# EAGLE design edu_shield (EAGLE 9.0.1)
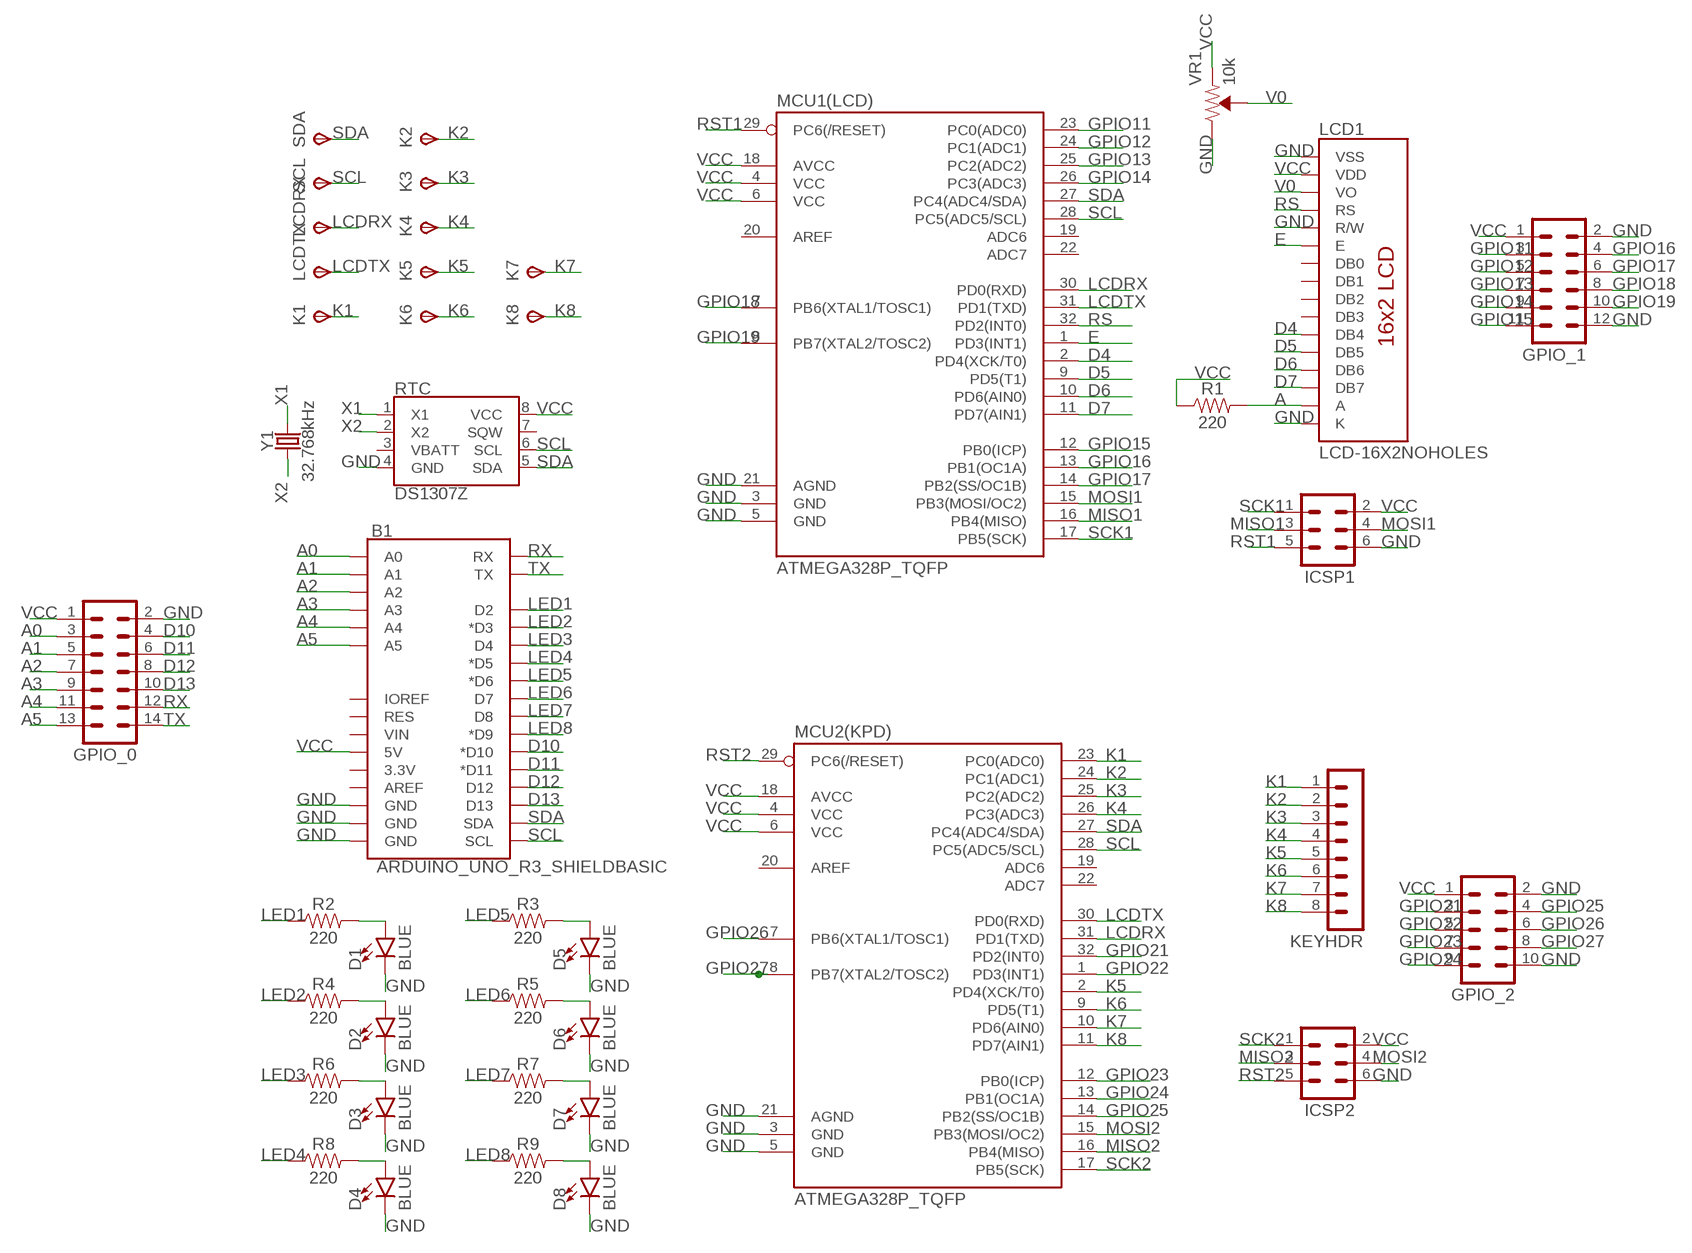
[diagram p0: schematic, sheet 1]

## Parts
B1  ARDUINO_UNO_R3_SHIELDBASIC  [UNO_R3_SHIELD]
D1  BLUE  LED-BLUE0603  [LED-0603]
D2  BLUE  LED-BLUE0603  [LED-0603]
D3  BLUE  LED-BLUE0603  [LED-0603]
D4  BLUE  LED-BLUE0603  [LED-0603]
D5  BLUE  LED-BLUE0603  [LED-0603]
D6  BLUE  LED-BLUE0603  [LED-0603]
D7  BLUE  LED-BLUE0603  [LED-0603]
D8  BLUE  LED-BLUE0603  [LED-0603]
GPIO_0  MA07-2  [MA07-2]
GPIO_1  MA06-2  [MA06-2]
GPIO_2  MA05-2  [MA05-2]
ICSP1  MA03-2  [MA03-2]
ICSP2  MA03-2  [MA03-2]
K1  TPSTP06SQ  [TP06SQ]
K2  TPSTP06SQ  [TP06SQ]
K3  TPSTP06SQ  [TP06SQ]
K4  TPSTP06SQ  [TP06SQ]
K5  TPSTP06SQ  [TP06SQ]
K6  TPSTP06SQ  [TP06SQ]
K7  TPSTP06SQ  [TP06SQ]
K8  TPSTP06SQ  [TP06SQ]
KEYHDR  MA08-1  [MA08-1]
LCD1  LCD-16X2NOHOLES  [LCD-16X2_NOHOLESNOSILK]
LCDRX  TPSTP06SQ  [TP06SQ]
LCDTX  TPSTP06SQ  [TP06SQ]
MCU1(LCD)  ATMEGA328P_TQFP  [TQFP32-08]
MCU2(KPD)  ATMEGA328P_TQFP  [TQFP32-08]
R1  220  220KOHM-0603-1/10W-1%  [0603]
R2  220  220KOHM-0603-1/10W-1%  [0603]
R3  220  220KOHM-0603-1/10W-1%  [0603]
R4  220  220KOHM-0603-1/10W-1%  [0603]
R5  220  220KOHM-0603-1/10W-1%  [0603]
R6  220  220KOHM-0603-1/10W-1%  [0603]
R7  220  220KOHM-0603-1/10W-1%  [0603]
R8  220  220KOHM-0603-1/10W-1%  [0603]
R9  220  220KOHM-0603-1/10W-1%  [0603]
RTC  DS1307Z  [SO08-0.15]
SCL  TPSTP06SQ  [TP06SQ]
SDA  TPSTP06SQ  [TP06SQ]
VR1  10k  TRIMPOT-PTH-10MM-KNOB-1/2W-10%  [TRIMPOT-PTH-3386U]
Y1  32.768kHz  CRYSTAL-32.768KHZPTH-2X6  [CRYSTAL-PTH-2X6-CYL]

## Nets
A: LCD1.15(A) R1.2
A0: B1.A0 GPIO_0.3
A1: B1.A1 GPIO_0.5
A2: B1.A2 GPIO_0.7
A3: B1.A3 GPIO_0.9
A4: B1.A4 GPIO_0.11
A5: B1.A5 GPIO_0.13
D4: LCD1.11(DB4) MCU1(LCD).2(PD4(XCK/T0))
D5: LCD1.12(DB5) MCU1(LCD).9(PD5(T1))
D6: LCD1.13(DB6) MCU1(LCD).10(PD6(AIN0))
D7: LCD1.14(DB7) MCU1(LCD).11(PD7(AIN1))
D10: B1.D10(*D10) GPIO_0.4
D11: B1.D11(*D11) GPIO_0.6
D12: B1.D12 GPIO_0.8
D13: B1.D13 GPIO_0.10
E: LCD1.6(E) MCU1(LCD).1(PD3(INT1))
GND: B1.GND@0(GND) B1.GND@1(GND) B1.GND@2(GND) D1.C D2.C D3.C D4.C D5.C D6.C D7.C D8.C GPIO_0.2 GPIO_1.2 GPIO_1.12 GPIO_2.2 GPIO_2.10 ICSP1.6 ICSP2.6 LCD1.1(VSS) LCD1.5(R/W) LCD1.16(K) MCU1(LCD).3(GND) MCU1(LCD).5(GND) MCU1(LCD).21(AGND) MCU2(KPD).3(GND) MCU2(KPD).5(GND) MCU2(KPD).21(AGND) RTC.4(GND) VR1.3(CW)
GPIO11: GPIO_1.3 MCU1(LCD).23(PC0(ADC0))
GPIO12: GPIO_1.5 MCU1(LCD).24(PC1(ADC1))
GPIO13: GPIO_1.7 MCU1(LCD).25(PC2(ADC2))
GPIO14: GPIO_1.9 MCU1(LCD).26(PC3(ADC3))
GPIO15: GPIO_1.11 MCU1(LCD).12(PB0(ICP))
GPIO16: GPIO_1.4 MCU1(LCD).13(PB1(OC1A))
GPIO17: GPIO_1.6 MCU1(LCD).14(PB2(SS/OC1B))
GPIO18: GPIO_1.8 MCU1(LCD).7(PB6(XTAL1/TOSC1))
GPIO19: GPIO_1.10 MCU1(LCD).8(PB7(XTAL2/TOSC2))
GPIO21: GPIO_2.3 MCU2(KPD).32(PD2(INT0))
GPIO22: GPIO_2.5 MCU2(KPD).1(PD3(INT1))
GPIO23: GPIO_2.7 MCU2(KPD).12(PB0(ICP))
GPIO24: GPIO_2.9 MCU2(KPD).13(PB1(OC1A))
GPIO25: GPIO_2.4 MCU2(KPD).14(PB2(SS/OC1B))
GPIO26: GPIO_2.6 MCU2(KPD).7(PB6(XTAL1/TOSC1))
GPIO27: GPIO_2.8 MCU2(KPD).8(PB7(XTAL2/TOSC2))
K1: K1.TP(PP) KEYHDR.1 MCU2(KPD).23(PC0(ADC0))
K2: K2.TP(PP) KEYHDR.2 MCU2(KPD).24(PC1(ADC1))
K3: K3.TP(PP) KEYHDR.3 MCU2(KPD).25(PC2(ADC2))
K4: K4.TP(PP) KEYHDR.4 MCU2(KPD).26(PC3(ADC3))
K5: K5.TP(PP) KEYHDR.5 MCU2(KPD).2(PD4(XCK/T0))
K6: K6.TP(PP) KEYHDR.6 MCU2(KPD).9(PD5(T1))
K7: K7.TP(PP) KEYHDR.7 MCU2(KPD).10(PD6(AIN0))
K8: K8.TP(PP) KEYHDR.8 MCU2(KPD).11(PD7(AIN1))
LCDRX: LCDRX.TP(PP) MCU1(LCD).30(PD0(RXD)) MCU2(KPD).31(PD1(TXD))
LCDTX: LCDTX.TP(PP) MCU1(LCD).31(PD1(TXD)) MCU2(KPD).30(PD0(RXD))
LED1: B1.D2 R2.1
LED2: B1.D3(*D3) R4.1
LED3: B1.D4 R6.1
LED4: B1.D5(*D5) R8.1
LED5: B1.D6(*D6) R3.1
LED6: B1.D7 R5.1
LED7: B1.D8 R7.1
LED8: B1.D9(*D9) R9.1
MISO1: ICSP1.3 MCU1(LCD).16(PB4(MISO))
MISO2: ICSP2.3 MCU2(KPD).16(PB4(MISO))
MOSI1: ICSP1.4 MCU1(LCD).15(PB3(MOSI/OC2))
MOSI2: ICSP2.4 MCU2(KPD).15(PB3(MOSI/OC2))
N$1: D1.A R2.2
N$2: D2.A R4.2
N$3: D3.A R6.2
N$4: D4.A R8.2
N$5: D8.A R9.2
N$6: D7.A R7.2
N$7: D6.A R5.2
N$8: D5.A R3.2
RS: LCD1.4(RS) MCU1(LCD).32(PD2(INT0))
RST1: ICSP1.5 MCU1(LCD).29(PC6(/RESET))
RST2: ICSP2.5 MCU2(KPD).29(PC6(/RESET))
RX: B1.RX GPIO_0.12
SCK1: ICSP1.1 MCU1(LCD).17(PB5(SCK))
SCK2: ICSP2.1 MCU2(KPD).17(PB5(SCK))
SCL: B1.SCL MCU1(LCD).28(PC5(ADC5/SCL)) MCU2(KPD).28(PC5(ADC5/SCL)) RTC.6(SCL) SCL.TP(PP)
SDA: B1.SDA MCU1(LCD).27(PC4(ADC4/SDA)) MCU2(KPD).27(PC4(ADC4/SDA)) RTC.5(SDA) SDA.TP(PP)
TX: B1.TX GPIO_0.14
V0: LCD1.3(VO) VR1.2(WIPER)
VCC: B1.5V GPIO_0.1 GPIO_1.1 GPIO_2.1 ICSP1.2 ICSP2.2 LCD1.2(VDD) MCU1(LCD).4(VCC) MCU1(LCD).6(VCC) MCU1(LCD).18(AVCC) MCU2(KPD).4(VCC) MCU2(KPD).6(VCC) MCU2(KPD).18(AVCC) R1.1 RTC.8(VCC) VR1.1(CCW)
X1: RTC.1(X1) Y1.2
X2: RTC.2(X2) Y1.1
Unconnected: B1.3.3V B1.AREF B1.IOREF B1.RES B1.VIN LCD1.7(DB0) LCD1.8(DB1) LCD1.9(DB2) LCD1.10(DB3) MCU1(LCD).19(ADC6) MCU1(LCD).20(AREF) MCU1(LCD).22(ADC7) MCU2(KPD).19(ADC6) MCU2(KPD).20(AREF) MCU2(KPD).22(ADC7) RTC.3(VBATT) RTC.7(SQW)

## Library data of the parts
B1 = SparkFun-Boards:ARDUINO_UNO_R3_SHIELD: Arduino R3 Shield Footprint Shield form compatible with the Arduino Uno R3. SparkFun Products: MG2639 Cellular Shield <https://www.sparkfun.com/products/13120> MIDI Shield <https://www.sparkfun.com/products/12898> R3 Stackable Headers Kit <https://www.sparkfun.com/products/11417>; OC_NEWARK: unknown
D1-D8 = SparkFun-LED:LED-BLUE: Blue SMD LED Used in manufacturing of various products at SparkFun Packages: 0603 - SMD 0603 package [Product Link] <http://www.digikey.com/product-detail/en/SMLE12BC7TT86/511-1589-2-ND/1641808> 1206 - SMD1206 package [Product Link] <http://www.digikey.com/product-detail/en/lite-on-inc/LTST-C150TBKT/160-1643-1-ND/573584> SparkFun Products: ESP8266 Thing-Dev Board <https://www.sparkfun.com/products/13711> RedBoard <https://www.sparkfun.com/products/12757>; MPN: KPHD-1608LVVBC-D; OC_NEWARK: 50AC9304; PROD_ID: DIO-08575
GPIO_0 = con-lstb:MA07-2: PIN HEADER; OC_FARNELL: unknown; OC_NEWARK: unknown
GPIO_1 = con-lstb:MA06-2: PIN HEADER; OC_FARNELL: unknown; OC_NEWARK: unknown
GPIO_2 = con-lstb:MA05-2: PIN HEADER; OC_FARNELL: unknown; OC_NEWARK: unknown
ICSP1 ICSP2 = con-lstb:MA03-2: PIN HEADER; OC_FARNELL: unknown; OC_NEWARK: unknown
K1-K8 LCDRX LCDTX SCL SDA = testpad:TPS: TEST PIN; OC_NEWARK: unknown
KEYHDR = con-lstb:MA08-1: PIN HEADER; OC_FARNELL: unknown; OC_NEWARK: unknown
LCD1 = SparkFun-Displays:LCD-16X2: Standard text-only 16x2 parallel input LCD Basic 16 character by 2 line display. Typically utilizes the extremely common HD44780 parallel interface chipset SparkFun Products: Basic 16x2 Green <https://www.sparkfun.com/products/255> Basic 8x2 Green <https://www.sparkfun.com/products/11122>; OC_NEWARK: unknown; SF_ID: LCD-00255
MCU1(LCD) MCU2(KPD) = SparkFun-IC-Microcontroller:ATMEGA328P_TQFP: Popular 328P in QFP Storefront component: ATmega328 - TQFP <https://www.sparkfun.com/products/13448> (COM-13448) Datasheet <http://www.sparkfun.com/datasheets/Components/SMD/ATMega328.pdf> SparkFun Products SparkFun RedBoard - Programmed with Arduino <https://www.sparkfun.com/products/12757> (DEV-12757) Arduino Pro Mini 328 - 5V/16MHz <https://www.sparkfun.com/products/11113> (DEV-11113) Arduino Pro Mini 328 - 3.3V/8MHz <https://www.sparkfun.com/products/11114> (DEV-11114) SparkFun OpenLog <https://www.sparkfun.com/products/13712> (DEV-13712) SparkFun MicroView - OLED Arduino Module <https://www.sparkfun.com/products/12923> (DEV-12923) SparkFun Digital Sandbox <https://www.sparkfun.com/products/12651> (DEV-12651) SparkFun PicoBoard <https://www.sparkfun.com/products/11888> (WIG-11888) Arduino Fio <https://www.sparkfun.com/products/10116> (DEV-10116) LilyPad Arduino 328 Main Board <https://www.sparkfun.com/products/13342> (DEV-13342) SparkFun RedStick <https://www.sparkfun.com/products/13741> (DEV-13741) LilyPad MP3 <https://www.sparkfun.com/products/11013> (DEV-11013) LilyPad Arduino SimpleSnap <https://www.sparkfun.com/products/10941> (DEV-10941) SparkFun Stepoko <https://www.sparkfun.com/products/13899> (ROB-13899) SparkFun Geiger Counter <https://www.sparkfun.com/products/11345> (SEN-11345) SparkFun EL Sequencer <https://www.sparkfun.com/products/12781> (COM-12781) Arduino Pro 328 - 5V/16MHz <https://www.sparkfun.com/products/10915> (DEV-10915) CryptoCape <https://www.sparkfun.com/products/12773> (DEV-12773) SparkFun IR Thermometer Evaluation Board - MLX90614 <https://www.sparkfun.com/products/10740> (SEN-10740) SparkFun RedBot Mainboard <https://www.sparkfun.com/products/12097> (ROB-12097) Arduino Pro 328 - 3.3V/8MHz <https://www.sparkfun.com/products/10914> (DEV-10914) SparkFun Block for Intel® Edison - Arduino <https://www.sparkfun.com/products/13036> (DEV-13036) SparkFun Simon Says - Surface Mount Soldering Kit <https://www.sparkfun.com/products/10935> (KIT-10935) SparkFun 7-Segment Serial Display - Red <https://www.sparkfun.com/products/11441> (COM-11441) SparkFun 7-Segment Serial Display - White <https://www.sparkfun.com/products/11629> (COM-11629) SparkFun 7-Segment Serial Display - Yellow <https://www.sparkfun.com/products/11443> (COM-11443) SparkFun 7-Segment Serial Display - Kelly Green <https://www.sparkfun.com/products/11440> (COM-11440) SparkFun 7-Segment Serial Display - Blue <https://www.sparkfun.com/products/11442> (COM-11442) SparkFun OpenSegment Serial Display - 20mm (Blue) <https://www.sparkfun.com/products/11647> (COM-11647) SparkFun OpenSegment Serial Display - 20mm (Green) <https://www.sparkfun.com/products/11646> (COM-11646) SparkFun OpenSegment Serial Display - 20mm (White) <https://www.sparkfun.com/products/11648> (COM-11648) SparkFun OpenSegment Serial Display - 20mm (Red) <https://www.sparkfun.com/products/11644> (COM-11644) SparkFun OpenSegment Serial Display - 20mm (Yellow) <https://www.sparkfun.com/products/11645> (COM-11645) SparkFun OpenSegment Shield <https://www.sparkfun.com/products/13190> (DEV-13190); OC_NEWARK: unknown; PROD_ID: IC-09069
R1-R9 = SparkFun-Resistors:220KOHM: 220kΩ resistor A resistor is a passive two-terminal electrical component that implements electrical resistance as a circuit element. Resistors act to reduce current flow, and, at the same time, act to lower voltage levels within circuits. - Wikipedia; MPN: MC0603SAF2200T5E; OC_NEWARK: 04P0328; PROD_ID: RES-08969; VALUE: 220k
RTC = SparkFun-Clocks:DS1307: Maxim DS1307 - I2C Real-time clock (RTC) The DS1307 serial real-time clock (RTC) is a low-power, full binary-coded decimal (BCD) clock/calendar plus 56 bytes of NV SRAM. Address and data are transferred serially through an I2C, bidirectional bus. The clock/calendar provides seconds, minutes, hours, day, date, month, and year information. SparkFun Products: Real Time Clock Module <https://www.sparkfun.com/products/12708> (BOB-12708) Datasheet <https://cdn.sparkfun.com/datasheets/BreakoutBoards/DS1307.pdf>; MPN: DS1307Z+T&R; OC_NEWARK: 38AC0917; PROD_ID: IC-08138
VR1 = SparkFun-Resistors:TRIMPOT: Trimming Potentiometer (Trimpot) Three-terminal potentiometers, with an adjustable wiper and two adjustable resistors. A pot can be used to create a configurable voltage divider, or as a variable resistor. "Trimpots" are a subset of potentiometers, usually intended for "set-and-forget" applications. They're often more delicate than standard potentiometers - rated for fewer turns. Variants PTH-KNOB - PTH Trimpot w/ finger-adjustable knob Trimpot 10K with Knob <https://www.sparkfun.com/products/9806> (COM-09806) Datasheet <http://www.sparkfun.com/datasheets/Components/General/TSR-3386.pdf> SMD-3MM-CLOSED-FRAME - SMD 3mm Square Closed-Frame Trimpot Used on e.g. EasyDriver - Stepper Motor Driver <https://www.sparkfun.com/products/12779> Datasheet <http://www.bitechnologies.com/pdfs/22.pdf> (22AR10KTR) SMD-5MM - SMD 5mm Square Closed-Frame Trimpot Used on e.g. IOIO-OTG - V2.2 <https://www.sparkfun.com/products/13613> Datasheet <http://www.vishay.com/docs/51008/ts53.pdf> (TS53YL502MR10) SMD-3MM-1/10W-25% - 3mm Square Open-Frame Trimpot Used on e.g. SparkFun Shapeoko <https://www.sparkfun.com/products/13899> Datasheet <http://www.bourns.com/docs/Product-Datasheets/TC33.pdf> (TC33X-2-103E); MF: BOURNS, INC.; MPN: 3296W-1-103LF; OC_NEWARK: 62J1423; PROD_ID: RES-09730; SF_SKU: COM-09806
Y1 = SparkFun-Clocks:CRYSTAL-32.768KHZ: 32.768kHz Crystal Frequency: 32.768kHz Frequency Stability: ±20ppm Load Capacitance: 12.5pF (PTH-2X6 & SMD-3.2X1.5), 6pF (SMD-2X6) SparkFun Products: SparkFun BigTime Watch Kit <https://www.sparkfun.com/products/11734> SparkFun nRF52832 Breakout <https://www.sparkfun.com/products/13990> SparkFun Real Time Clock Module <https://www.sparkfun.com/products/12708>; MF: Abracon Corporation; MPN: AB38T-32.768KHZ; OC_NEWARK: 13J1829; PROD_ID: XTAL-10112

## Board
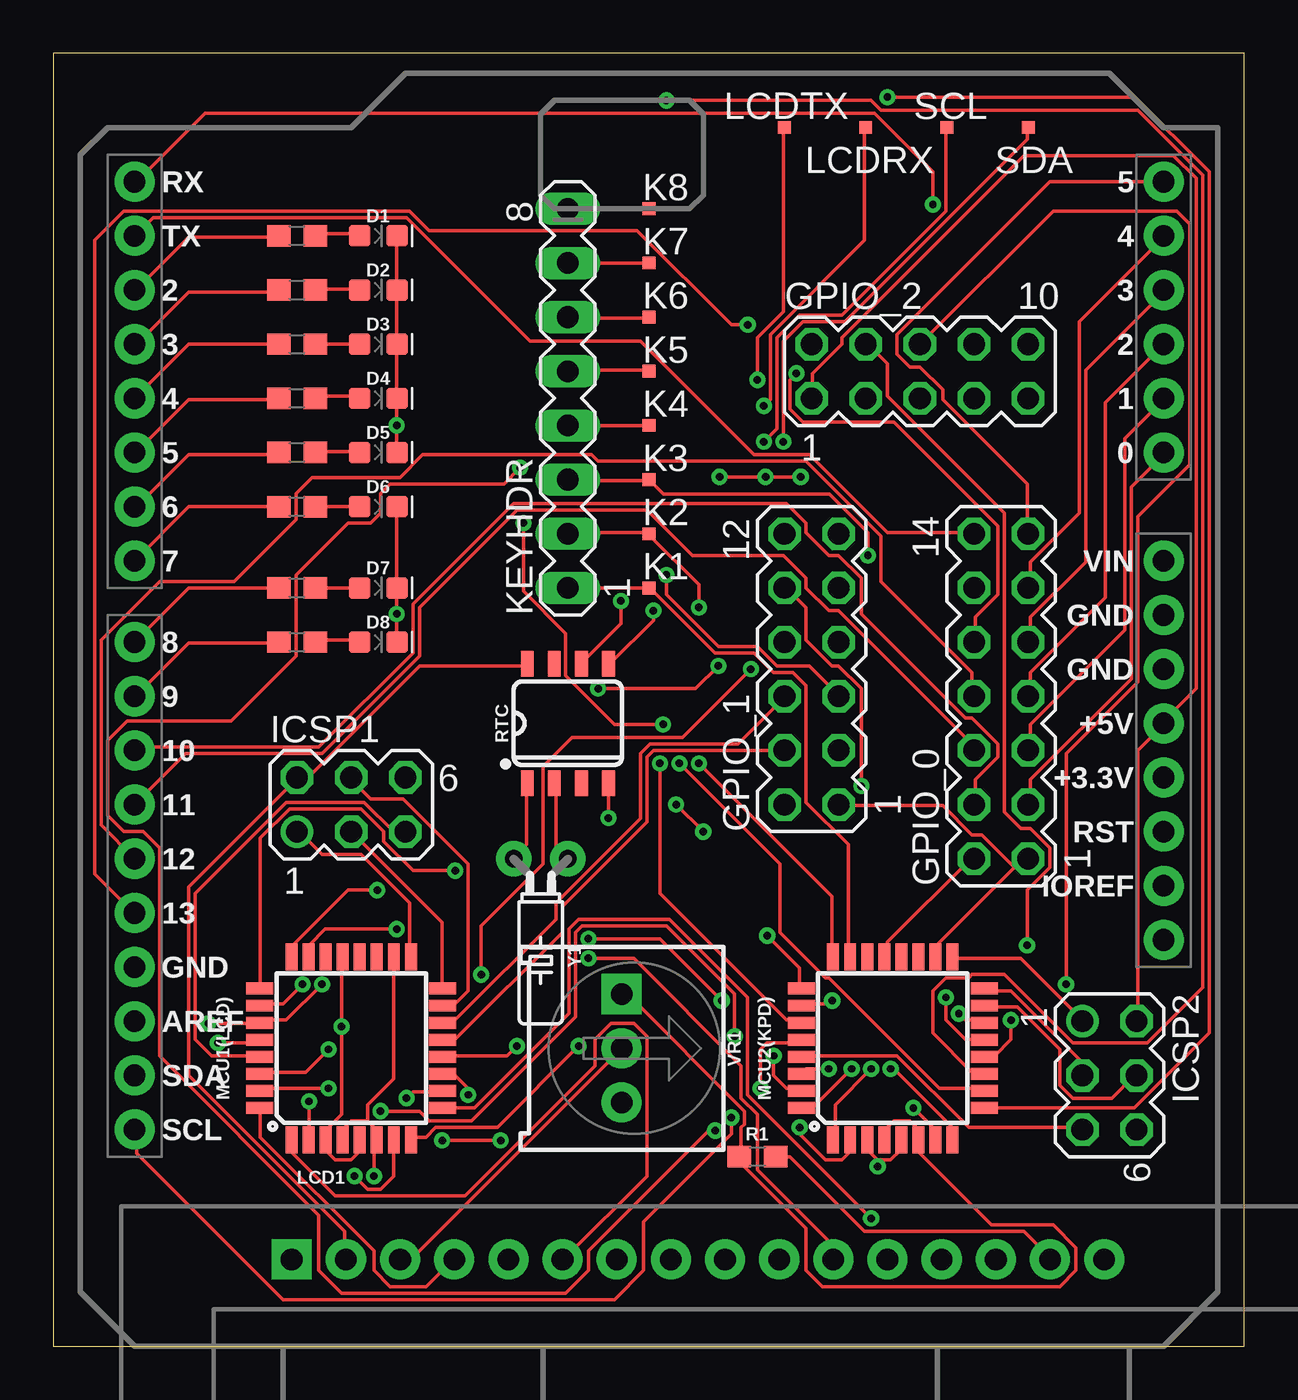
[diagram p1: board, top side]
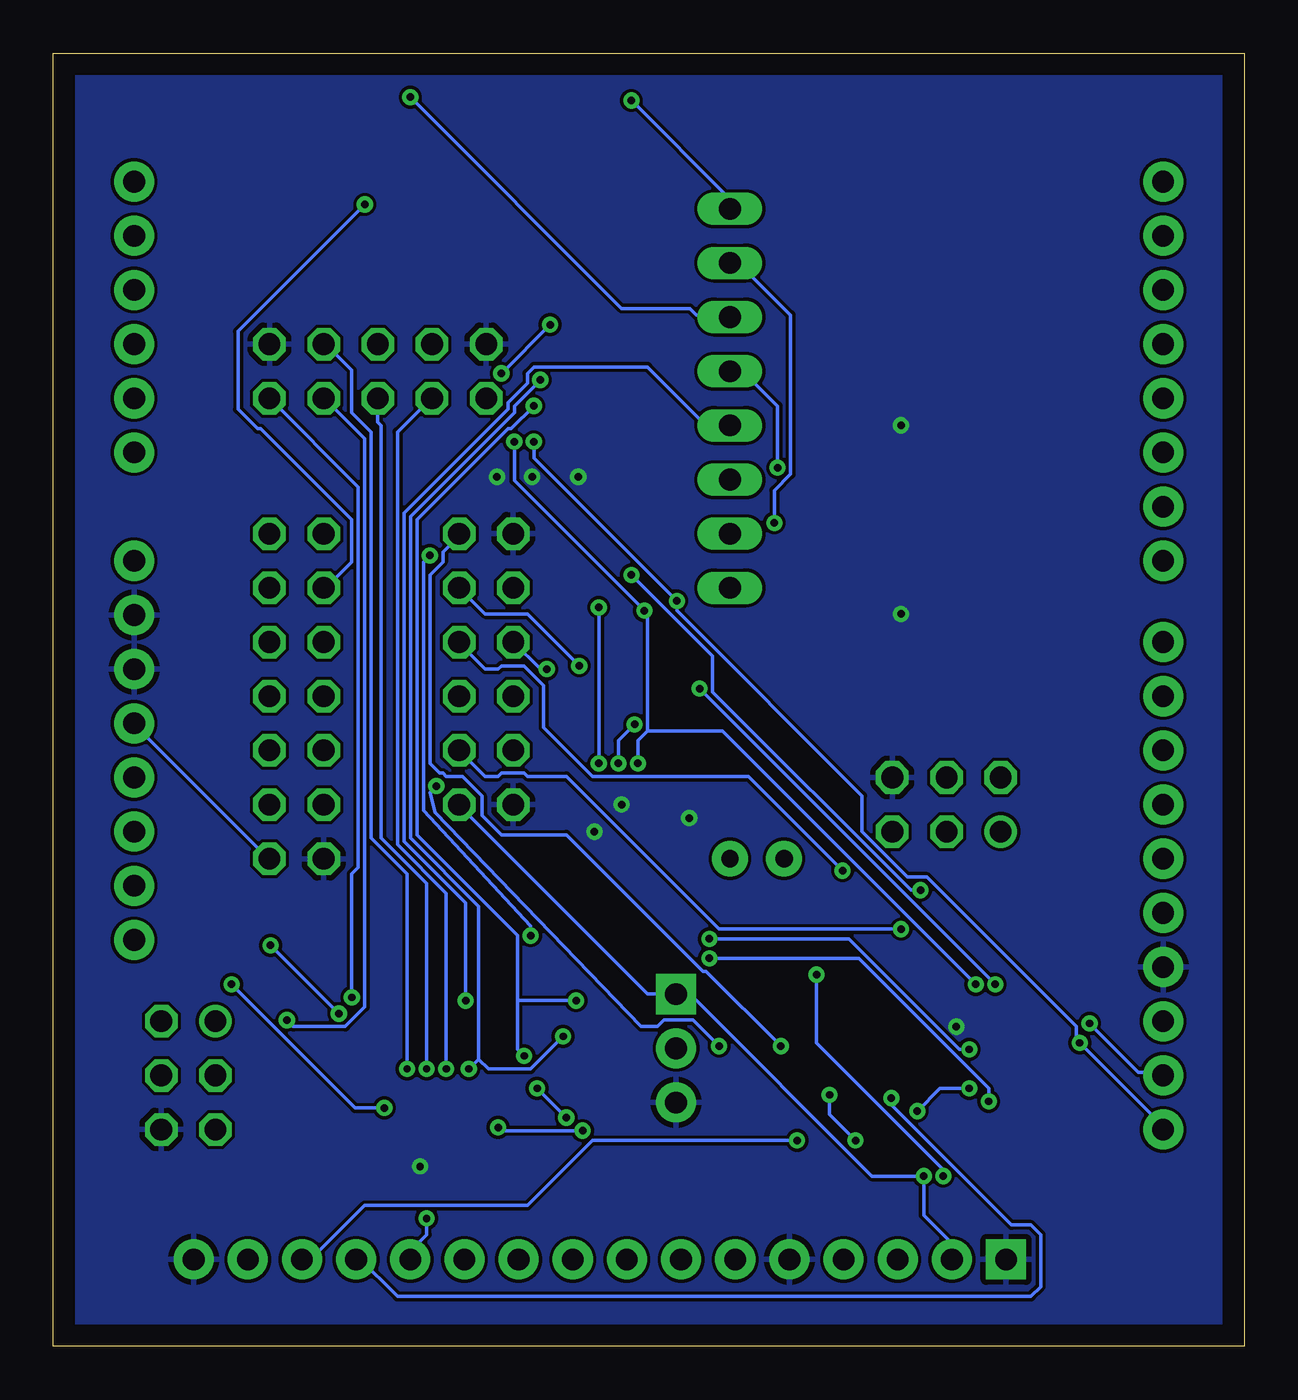
[diagram p2: board, bottom side, seen from below]

Size 55.86 x 60.63 mm. Coordinates in mm from the lower left corner, seen from the top.
Outline: 0,0 55.86,0 55.86,60.63 0,60.63 0,0
Copper layers (1*16): Top 0.035mm / dielectric 1.5mm / Bottom 0.035mm
Design rules "default": minimum track width 6mil, minimum drill 0.35mm, track to track 6mil, track to pad 6mil, pad to pad 6mil, via to via 6mil, smd to smd 6mil, copper to edge 40mil, drill to drill 6mil, minimum pad ring 10mil, minimum via ring 8mil, stop-mask expansion 4mil, vias tented up to drill 0mil, thermal gap 10mil

### Footprints (pad centres in the part's own frame; a part is rotated, then mirrored left to right if it is on the bottom)
UNO_R3_SHIELD = drill 1.016 pad 1.88: 3.3V 24.13,-2.54; 5V 24.13,0; A0 24.13,12.7; A1 24.13,15.24; A2 24.13,17.78; A3 24.13,20.32; A4 24.13,22.86; A5 24.13,25.4; AREF -24.13,-13.97; D2 -24.13,20.32; D3 -24.13,17.78; D4 -24.13,15.24; D5 -24.13,12.7; D6 -24.13,10.16; D7 -24.13,7.62; D8 -24.13,3.81; D9 -24.13,1.27; D10 -24.13,-1.27; D11 -24.13,-3.81; D12 -24.13,-6.35; D13 -24.13,-8.89; GND@0 24.13,2.54; GND@1 24.13,5.08; GND@2 -24.13,-11.43; IOREF 24.13,-7.62; NC 24.13,-10.16; RES 24.13,-5.08; RX -24.13,25.4; SCL -24.13,-19.05; SDA -24.13,-16.51; TX -24.13,22.86; VIN 24.13,7.62
LED-0603 = smd 1 x 1: A -0.877,0; C 0.877,0
MA07-2 = drill 1.016 octagon: 1 -7.62,-1.27; 2 -7.62,1.27; 3 -5.08,-1.27; 4 -5.08,1.27; 5 -2.54,-1.27; 6 -2.54,1.27; 7 0,-1.27; 8 0,1.27; 9 2.54,-1.27; 10 2.54,1.27; 11 5.08,-1.27; 12 5.08,1.27; 13 7.62,-1.27; 14 7.62,1.27
MA06-2 = drill 1.016 octagon: 1 -6.35,-1.27; 2 -6.35,1.27; 3 -3.81,-1.27; 4 -3.81,1.27; 5 -1.27,-1.27; 6 -1.27,1.27; 7 1.27,-1.27; 8 1.27,1.27; 9 3.81,-1.27; 10 3.81,1.27; 11 6.35,-1.27; 12 6.35,1.27
MA05-2 = drill 1.016 octagon: 1 -5.08,-1.27; 2 -5.08,1.27; 3 -2.54,-1.27; 4 -2.54,1.27; 5 0,-1.27; 6 0,1.27; 7 2.54,-1.27; 8 2.54,1.27; 9 5.08,-1.27; 10 5.08,1.27
MA03-2 = drill 1.016: 1 -2.54,-1.27 | drill 1.016 octagon: 2 -2.54,1.27; 3 0,-1.27; 4 0,1.27; 5 2.54,-1.27; 6 2.54,1.27
TP06SQ = smd 0.6 x 0.6: TP 0,0
MA08-1 = drill 1.016 long: 1 -8.89,0; 2 -6.35,0; 3 -3.81,0; 4 -1.27,0; 5 1.27,0; 6 3.81,0; 7 6.35,0; 8 8.89,0
LCD-16X2_NOHOLESNOSILK = drill 1.016 pad 1.88 square: 1 -32,15.5 | drill 1.016 pad 1.88: 2 -29.46,15.5; 3 -26.92,15.5; 4 -24.38,15.5; 5 -21.84,15.5; 6 -19.3,15.5; 7 -16.76,15.5; 8 -14.22,15.5; 9 -11.68,15.5; 10 -9.14,15.5; 11 -6.6,15.5; 12 -4.06,15.5; 13 -1.52,15.5; 14 1.02,15.5; 15 3.56,15.5; 16 6.1,15.5
TQFP32-08 = smd 1.27 x 0.559: 1 -4.293,2.8; 2 -4.293,2; 3 -4.293,1.2; 4 -4.293,0.4; 5 -4.293,-0.4; 6 -4.293,-1.2; 7 -4.293,-2; 8 -4.293,-2.8; 17 4.293,-2.8; 18 4.293,-2; 19 4.293,-1.2; 20 4.293,-0.4; 21 4.293,0.4; 22 4.293,1.2; 23 4.293,2; 24 4.293,2.8 | smd 0.559 x 1.27: 9 -2.8,-4.293; 10 -2,-4.293; 11 -1.2,-4.293; 12 -0.4,-4.293; 13 0.4,-4.293; 14 1.2,-4.293; 15 2,-4.293; 16 2.8,-4.293; 25 2.8,4.293; 26 2,4.293; 27 1.2,4.293; 28 0.4,4.293; 29 -0.4,4.293; 30 -1.2,4.293; 31 -2,4.293; 32 -2.8,4.293
0603 = smd 1.1 x 1: 1 -0.85,0; 2 0.85,0
SO08-0.15 = smd 0.6 x 1.2: 1 -1.905,-2.8; 2 -0.635,-2.8; 3 0.635,-2.8; 4 1.905,-2.8; 5 1.905,2.8; 6 0.635,2.8; 7 -0.635,2.8; 8 -1.905,2.8
TRIMPOT-PTH-3386U = drill 1.016 pad 1.88 square: 1 -2.54,-0.015 | drill 1.016 pad 1.88: 2 0,-0.015; 3 2.54,-0.015
CRYSTAL-PTH-2X6-CYL = drill 0.813 pad 1.676: 1 -1.27,0; 2 1.27,0

### Placement (x,y rotation side)
B1  27.94,29.21 0 top
D1  15.24,52.07 0 top
D2  15.24,49.53 0 top
D3  15.24,46.99 0 top
D4  15.24,44.45 0 top
D5  15.24,41.91 0 top
D6  15.24,39.37 0 top
D7  15.24,35.56 0 top
D8  15.24,33.02 0 top
GPIO_0  44.45,30.48 90 top
GPIO_1  35.56,31.75 90 top
GPIO_2  40.64,45.72 0 top
ICSP1  13.97,25.4 0 top
ICSP2  49.53,12.7 270 top
K1  27.94,35.56 0 top
K2  27.94,38.1 0 top
K3  27.94,40.64 0 top
K4  27.94,43.18 0 top
K5  27.94,45.72 0 top
K6  27.94,48.26 0 top
K7  27.94,50.8 0 top
K8  27.94,53.34 0 top
KEYHDR  24.13,44.45 90 top
LCD1  43.18,-11.43 0 top
LCDRX  38.1,57.15 0 top
LCDTX  34.29,57.15 0 top
MCU1(LCD)  13.97,13.97 90 top
MCU2(KPD)  39.37,13.97 90 top
R1  33.02,8.89 0 top
R2  11.43,52.07 0 top
R3  11.43,41.91 0 top
R4  11.43,49.53 0 top
R5  11.43,39.37 0 top
R6  11.43,46.99 0 top
R7  11.43,35.56 0 top
R8  11.43,44.45 0 top
R9  11.43,33.02 0 top
RTC  24.13,29.21 0 top
SCL  41.91,57.15 0 top
SDA  45.72,57.15 0 top
VR1  26.67,13.97 270 top
Y1  22.86,22.86 180 top

### Tracks (layer width: path | path; a pad name or v marks a point on that pad's centre or on a via)
A
  Top 0.152: R1.2 34.54,8.89 38.05,5.38 45.52,5.38 46.74,4.17 LCD1.15
A0
  Top 0.152: GPIO_0.3 45.82,25.5 45.82,26.57 50.55,31.29 50.55,40.28 52.07,41.81 B1.A0
A1
  Top 0.152: GPIO_0.5 45.82,27.94 45.82,29.16 50.24,33.58 50.24,42.57 52.07,44.4 B1.A1
A2
  Top 0.152: B1.A2 49.33,44.25 49.33,35.1 45.82,31.6 45.82,30.53 GPIO_0.7
A3
  Top 0.152: GPIO_0.9 45.82,33.12 45.82,34.19 48.41,36.78 48.41,45.77 52.07,49.43 B1.A3
A4
  Top 0.152: GPIO_0.11 45.82,35.56 45.82,36.78 48.11,39.06 48.11,48.06 52.07,52.02 B1.A4
A5
  Top 0.152: B1.A5 46.74,54.61 39.57,47.45 39.57,46.53 40.18,45.92 40.64,45.92 41.71,44.86 41.71,44.4 45.67,40.44 45.67,38.15 GPIO_0.13
D4  (via drill 0.35)
  Top 0.152: v11.99,11.48 11.99,9.8 MCU1(LCD).2 | v25.09,18.19 27.23,18.19 32.26,13.16 32.26,11.63 33.02,10.87 33.02,8.28 36.52,4.78 36.52,4.17 LCD1.11
  Bottom 0.152: v11.99,11.48 11.99,12.09 18.09,18.19 v25.09,18.19
D5  (via drill 0.35)
  Top 0.152: v38.35,5.99 32.56,11.79 32.56,16.36 28.91,20.02 24.64,20.02 24.18,19.56 24.18,15.6 19.76,11.18 18.39,11.18 MCU1(LCD).9
  Bottom 0.152: v38.35,5.99 38.35,5.23 39.12,4.47 39.12,4.17 LCD1.12
D6  (via drill 0.35)
  Top 0.152: v16.56,11.63 16.87,11.94 18.24,11.94 MCU1(LCD).10
  Bottom 0.152: v16.56,11.63 16.56,11.33 10.92,5.69 10.01,5.69 9.55,5.23 9.55,2.79 10.01,2.34 39.73,2.34 41.55,4.17 LCD1.13
D7  (via drill 0.35)
  Top 0.152: v19.46,11.79 19.46,12.09 18.85,12.7 18.39,12.7 MCU1(LCD).11 | v20.98,9.65 v18.24,9.65
  Bottom 0.152: v19.46,11.79 19.46,10.87 v18.24,9.65 | v20.98,9.65 30.58,9.65 33.63,6.6 41.25,6.6 43.69,4.17 44.14,4.17 LCD1.14
D10
  Top 0.152: GPIO_0.4 43.23,25.5 43.23,26.57 44.3,27.64 44.3,28.25 43.08,29.46 42.77,29.46 37.9,34.34 37.9,36.02 36.83,37.08 36.37,37.08 35.31,38.15 35.31,38.61 34.39,39.52 21.59,39.52 16.87,34.8 16.87,32.51 12.45,28.09 4.06,28.09 3.91,27.94 B1.D10
D11
  Top 0.152: B1.D11 6.2,27.79 12.6,27.79 17.17,32.36 17.17,34.65 21.74,39.22 27.84,39.22 29.97,37.08 34.24,37.08 35.31,36.02 35.31,35.56 36.37,34.49 36.83,34.49 43.08,28.25 43.08,27.94 GPIO_0.6
D12
  Top 0.152: B1.D12 2.23,24.44 2.23,33.12 4.98,35.87 8.48,35.87 11.38,38.76 11.38,39.98 12.14,40.74 16.26,40.74 17.32,41.81 25.25,41.81 25.55,41.5 35.31,41.5 38.81,38 38.81,35.87 43.08,31.6 43.08,30.53 GPIO_0.8
D13  (via drill 0.35)
  Top 0.152: v34.85,45.62 34.54,45.31 34.54,43.94 35.15,43.33 39.42,43.33 44.3,38.46 44.3,35.26 43.23,34.19 43.23,33.12 GPIO_0.10 | v32.56,47.9 31.8,47.9 27.38,52.32 17.63,52.32 16.71,53.24 3.3,53.24 1.93,51.87 1.93,22.15 3.76,20.32 B1.D13
  Bottom 0.152: v32.56,47.9 v34.85,45.62
E
  Top 0.152: MCU1(LCD).1 11.23,9.65 11.23,9.04 13.21,7.06 19.3,7.06 25.4,13.16 25.4,14.38 26.16,15.14 27.23,15.14 27.84,14.53 27.84,7.98 24.03,4.17 LCD1.6
GND  (via drill 0.35, 0.35 pad 0.55)
  Top 0.152: MCU1(LCD).5 14.28,9.65 14.28,9.04 13.97,8.74 13.21,8.74 12.9,9.04 12.9,9.65 MCU1(LCD).3 12.9,9.8 12.9,10.26 13.51,10.87 v13.51,14.99 13.51,18.19 MCU1(LCD).21 | D5.C 16.1,41.96 v16.1,43.18 16.1,44.4 D4.C 16.1,44.55 16.1,46.99 | 16.1,46.99 16.1,49.43 D2.C 16.1,49.58 16.1,52.02 D1.C | 16.1,46.99 D3.C | 16.1,35.56 v16.1,34.34 16.1,33.12 D8.C | 16.1,35.56 16.1,39.37 D6.C | 16.1,35.56 D7.C | 38.66,8.74 38.2,9.2 38.2,9.65 MCU2(KPD).3 | 38.66,8.74 39.27,8.74 39.73,9.2 39.73,9.65 MCU2(KPD).5 | MCU2(KPD).21 39.12,18.34 39.12,18.95 43.03,22.86 GPIO_0.2 43.08,22.91 | v38.66,8.43 38.66,8.74 | v35.05,40.77 v33.4,40.77 v31.24,40.77 | v29.21,25.4 v30.48,24.13 | RTC.4 v26.04,24.77
  pour Bottom: -1.27,62.23 57.15,62.23 57.15,-1.27 -1.27,-1.27
GPIO11  (via drill 0.35)
  Top 0.152: v16.1,19.56 12.75,19.56 11.99,18.8 11.99,18.34 MCU1(LCD).23
  Bottom 0.152: v16.1,19.56 24.64,19.56 31.8,26.72 33.63,26.72 33.78,26.87 34.85,26.87 35,26.72 35.61,26.72 GPIO_1.3
GPIO12  (via drill 0.35)
  Top 0.152: v15.19,21.39 13.82,21.39 11.23,18.8 11.23,18.34 MCU1(LCD).24 | v28.75,36.17 28.75,35.26 31.19,32.82 33.02,32.82 33.93,31.9 35.46,31.9 36.83,30.53 GPIO_1.5
  Bottom 0.152: v15.19,21.39 15.65,21.39 24.94,30.68 24.94,32.36 v28.75,36.17
GPIO13  (via drill 0.35)
  Top 0.152: v18.85,22.3 16.87,22.3 15.49,23.67 15.49,24.13 14.43,25.2 11.07,25.2 9.7,23.82 9.7,16.82 MCU1(LCD).25
  Bottom 0.152: v18.85,22.3 23.27,26.72 30.58,26.72 32.87,29.01 32.87,30.99 33.78,31.9 34.85,31.9 35,31.75 35.61,31.75 36.83,32.97 GPIO_1.7
GPIO14  (via drill 0.35)
  Top 0.152: v11.68,16.97 10.77,16.05 9.7,16.05 MCU1(LCD).26 | v25.55,30.84 30.12,30.84 v31.19,31.9
  Bottom 0.152: v25.55,30.84 v11.68,16.97 | v31.19,31.9 33.63,34.34 35.61,34.34 GPIO_1.9
GPIO15  (via drill 0.35)
  Top 0.152: v21.74,14.07 21.29,13.61 18.39,13.61 MCU1(LCD).12
  Bottom 0.152: v21.74,14.07 25.25,17.58 25.4,17.58 31.8,23.98 34.85,23.98 35.76,24.89 35.76,25.81 36.68,26.72 37.44,26.72 37.59,26.87 37.74,26.87 38.2,27.33 38.2,36.17 37.59,36.78 37.59,37.24 36.83,38 GPIO_1.11
GPIO16
  Top 0.152: GPIO_1.4 28.14,27.94 27.84,27.64 27.84,24.59 23.88,20.62 23.88,19.41 18.85,14.38 18.39,14.38 MCU1(LCD).13
GPIO17
  Top 0.152: MCU1(LCD).14 18.39,15.29 18.85,15.29 23.57,20.02 23.57,20.78 27.53,24.74 27.53,27.79 27.99,28.25 32.11,28.25 34.24,30.38 GPIO_1.6
GPIO18  (via drill 0.35)
  Top 0.152: v14.12,7.98 14.73,7.37 15.34,7.37 15.95,7.98 15.95,9.65 MCU1(LCD).7 | v20.07,17.42 20.07,19.71 22.96,22.61 22.96,27.18 24.33,28.55 29.52,28.55 v32.71,31.75
  Bottom 0.152: v14.12,7.98 14.12,8.28 20.07,14.22 v20.07,17.42 | v32.71,31.75 33.02,31.75 GPIO_1.8
GPIO19  (via drill 0.35)
  Top 0.152: v24.64,14.07 20.83,10.26 17.93,10.26 17.48,9.8 16.87,9.8 MCU1(LCD).8 | v37.9,26.26 37.9,30.84 36.83,31.9 36.52,31.9 35.31,33.12 35.31,34.65 34.39,35.56 GPIO_1.10
  Bottom 0.152: v24.64,14.07 25.86,15.29 27.23,15.29 27.53,14.99 28.3,14.99 37.95,25.02 38.2,25.96 v37.9,26.26
GPIO21  (via drill 0.35)
  Top 0.152: v37.44,13 35.61,11.18 35.15,11.18 MCU2(KPD).32
  Bottom 0.152: v37.44,13 37.44,21.23 39.73,23.52 39.73,42.88 38.2,44.4 GPIO_2.3
GPIO22  (via drill 0.35)
  Top 0.152: v38.35,13 36.68,11.33 36.68,9.8 MCU2(KPD).1
  Bottom 0.152: v38.35,13 38.35,21.69 40.49,23.82 40.49,43.18 40.64,43.33 GPIO_2.5
GPIO23  (via drill 0.35)
  Top 0.152: v44.91,15.29 44.91,14.38 44.14,13.61 43.69,13.61 MCU2(KPD).12
  Bottom 0.152: v44.91,15.29 44.6,14.99 42.16,14.99 41.25,15.9 41.25,42.57 43.08,44.4 GPIO_2.7
GPIO24  (via drill 0.35)
  Top 0.152: v41.86,16.36 41.86,15.29 42.77,14.38 43.54,14.38 MCU2(KPD).13
  Bottom 0.152: v41.86,16.36 41.86,22.15 41.55,22.45 41.55,40.28 GPIO_2.9
GPIO25  (via drill 0.35)
  Top 0.152: v42.47,15.6 42.77,15.29 43.54,15.29 MCU2(KPD).14 | v45.67,18.8 45.67,21.39 46.74,22.45 46.74,23.37 45.82,24.28 45.36,24.28 44.6,25.04 44.6,39.06 39.12,44.55 39.12,46.08 38.2,46.99 GPIO_2.4
  Bottom 0.152: v45.67,18.8 v42.47,15.6
GPIO26  (via drill 0.35)
  Top 0.152: v40.33,11.18 41.25,10.26 41.25,9.8 MCU2(KPD).7 | v47.5,16.97 47.5,27.79 50.85,31.14 50.85,38.91 53.29,41.35 53.29,52.63 52.68,53.24 46.89,53.24 GPIO_2.6
  Bottom 0.152: v40.33,11.18 41.71,11.18 v47.5,16.97
GPIO27  (via drill 0.35)
  Top 0.152: v39.27,13 39.42,13 42.16,10.26 42.16,9.8 MCU2(KPD).8
  Bottom 0.152: v39.27,13 39.27,22.15 40.95,23.82 40.95,42.88 41.86,43.79 41.86,45.77 43.08,46.99 GPIO_2.8
K1
  Top 0.152: KEYHDR.1 K1.TP 27.99,35.56 31.04,32.51 32.87,32.51 33.78,31.6 34.7,31.6 35.31,30.99 35.31,25.5 37.29,23.52 37.29,18.34 MCU2(KPD).23
K2  (via drill 0.35)
  Top 0.152: KEYHDR.2 24.18,38.15 27.84,38.15 K2.TP 27.99,38 30.28,35.71 v30.28,34.65 | v30.28,27.33 36.52,21.08 36.52,18.34 MCU2(KPD).24
  Bottom 0.152: v30.28,34.65 v30.28,27.33
K3  (via drill 0.35)
  Top 0.152: KEYHDR.3 24.18,40.59 27.84,40.59 K3.TP 28.63,39.95 36.4,39.95 38.2,38.15 v38.2,37.08 | v33.48,19.25 35,17.73 35,16.82 MCU2(KPD).25
  Bottom 0.152: v33.48,19.25 33.48,19.71 38.51,25.12 38.51,36.78 v38.2,37.08
K4  (via drill 0.35)
  Top 0.152: KEYHDR.4 K4.TP | v36.52,16.21 36.37,16.05 35.15,16.05 MCU2(KPD).26
  Bottom 0.152: v36.52,16.21 36.52,20.78 39.42,23.67 39.42,39.06 34.54,43.94 34.54,44.25 33.63,45.16 33.63,45.62 33.32,45.92 27.99,45.92 25.25,43.18 KEYHDR.4
K5  (via drill 0.35)
  Top 0.152: K5.TP 27.84,45.77 24.18,45.77 KEYHDR.5 | v35,10.26 35,9.96 36.22,8.74 36.98,8.74 37.29,9.04 37.29,9.65 MCU2(KPD).2 | v31.04,10.11 30.73,10.11 25.09,4.47 25.09,3.56 24.03,2.49 13.51,2.49 12.45,3.56 12.45,6.15 4.98,13.61 4.98,23.37 4.22,24.13 3.3,24.13 2.54,24.89 2.54,28.4 3.45,29.31 8.33,29.31 11.38,32.36 11.38,36.17 13.82,38.61 14.88,38.61 15.34,39.06 15.34,39.98 15.8,40.44 21.13,40.44 v21.89,41.2
  Bottom 0.152: v35,10.26 34.85,10.11 v31.04,10.11 | v21.89,41.2 21.89,44.09 23.42,45.62 24.03,45.62 KEYHDR.5
K6  (via drill 0.35)
  Top 0.152: K6.TP 27.84,48.21 24.18,48.21 KEYHDR.6 | v39.12,58.57 50.7,58.57 54.2,55.07 54.2,14.68 50.7,11.18 43.69,11.18 MCU2(KPD).9
  Bottom 0.152: v39.12,58.57 29.21,48.67 26.01,48.67 25.71,48.36 24.18,48.36 KEYHDR.6
K7  (via drill 0.35)
  Top 0.152: KEYHDR.7 K7.TP | v29.36,27.33 34.09,22.61 34.09,19.41 36.22,17.27 36.37,17.27 41.55,12.09 43.54,12.09 MCU2(KPD).10 | v28.6,29.16 26.31,29.16 24.03,31.45 24.03,33.43 22.05,35.41 v22.05,38.61
  Bottom 0.152: v29.36,27.33 29.36,28.4 v28.6,29.16 | v22.05,38.61 22.05,40.13 21.29,40.89 21.29,48.36 23.72,50.8 KEYHDR.7
K8  (via drill 0.35)
  Top 0.152: K8.TP 27.84,53.39 24.18,53.39 KEYHDR.8 | v28.75,58.42 38.35,58.42 38.81,57.96 50.85,57.96 53.9,54.91 53.9,16.82 51.31,14.22 47.8,14.22 44.6,17.42 43.08,17.42 42.93,17.27 41.86,17.27 41.25,16.66 41.25,14.68 43.08,12.85 43.54,12.85 MCU2(KPD).11
  Bottom 0.152: v28.75,58.42 24.18,53.85 24.18,53.39 KEYHDR.8
LCDRX  (via drill 0.35)
  Top 0.152: v33.32,44.09 33.63,44.4 33.63,47.45 38.05,51.87 38.05,57.05 LCDRX.TP | v33.78,13.61 33.78,12.7 34.39,12.09 35,12.09 MCU2(KPD).31 | v12.9,13.92 11.84,12.85 9.7,12.85 MCU1(LCD).30 | v25.09,19.1 28.45,19.1 v31.34,16.21
  Bottom 0.152: v33.32,44.09 34.39,43.03 34.54,43.03 38.81,38.76 38.81,23.98 34.09,19.25 34.09,16.21 | 34.09,16.21 34.09,13.92 v33.78,13.61 | v12.9,13.92 13.36,13.92 18.54,19.1 v25.09,19.1 | 34.09,16.21 v31.34,16.21
LCDTX  (via drill 0.35)
  Top 0.152: v33.02,45.31 33.02,47.3 34.24,48.51 34.24,57.05 LCDTX.TP | v36.37,13 35.31,13 35.15,12.85 MCU2(KPD).30 | v12.9,12.09 9.7,12.09 MCU1(LCD).31 | v15.34,11.02 17.17,11.02 17.63,10.57 19.61,10.57 24.49,15.44 24.49,19.41 24.79,19.71 28.75,19.71 31.95,16.51 v31.95,14.53
  Bottom 0.152: v33.02,45.31 34.24,44.09 34.24,43.79 39.12,38.91 39.12,23.82 35.92,20.62 35.92,13.46 | v36.37,13 35.92,13.46 | v12.9,12.09 14.28,12.09 v15.34,11.02 | v31.95,14.53 33.48,13 35.46,13 35.92,13.46
LED1
  Top 0.152: R2.1 10.46,52.02 6.35,52.02 3.91,49.58 B1.D2
LED2
  Top 0.152: R4.1 10.46,49.43 6.35,49.43 3.91,46.99 B1.D3
LED3
  Top 0.152: R6.1 6.35,46.99 B1.D4
LED4
  Top 0.152: R8.1 10.46,44.4 6.35,44.4 3.91,41.96 B1.D5
LED5
  Top 0.152: R3.1 10.46,41.81 6.35,41.81 3.91,39.37 B1.D6
LED6
  Top 0.152: R5.1 6.35,39.37 B1.D7
LED7
  Top 0.152: R7.1 6.35,35.56 B1.D8
LED8
  Top 0.152: R9.1 10.46,32.97 6.35,32.97 3.91,30.53 B1.D9
MISO1
  Top 0.152: ICSP1.3 18.24,19.86 18.24,16.82 MCU1(LCD).16
MISO2
  Top 0.152: ICSP2.3 48.26,13.31 44.91,16.66 43.69,16.66 MCU2(KPD).16
MOSI1
  Top 0.152: MCU1(LCD).15 18.39,16.05 18.85,16.05 19.46,16.66 19.46,22.61 16.41,25.65 14.88,25.65 13.97,26.57 ICSP1.4
MOSI2
  Top 0.152: MCU2(KPD).15 43.69,15.9 45.21,15.9 47.19,13.92 47.19,12.24 47.8,11.63 49.63,11.63 50.7,12.7 ICSP2.4
N$1
  Top 0.152: D1.A 14.28,52.17 12.29,52.17 R2.2
N$2
  Top 0.152: D2.A 14.28,49.58 12.29,49.58 R4.2
N$3
  Top 0.152: R6.2 D3.A
N$4
  Top 0.152: D4.A 14.28,44.55 12.29,44.55 R8.2
N$5
  Top 0.152: D8.A 14.28,33.12 12.29,33.12 R9.2
N$6
  Top 0.152: R7.2 D7.A
N$7
  Top 0.152: R5.2 D6.A
N$8
  Top 0.152: D5.A 14.28,41.96 12.29,41.96 R3.2
RS
  Top 0.152: MCU1(LCD).32 9.7,11.02 9.7,9.8 15.04,4.47 15.04,3.56 15.8,2.79 17.48,2.79 18.69,4.01 LCD1.4
RST1
  Top 0.152: ICSP1.5 15.95,24.13 14.58,25.5 10.92,25.5 6.65,21.23 6.65,14.38 7.42,13.61 9.55,13.61 MCU1(LCD).29
RST2
  Top 0.152: MCU2(KPD).29 35.15,13.61 39.57,13.61 42.93,10.26 48.26,10.26 ICSP2.5
RX  (via drill 0.35)
  Top 0.152: v41.25,53.54 41.25,55.07 38.51,57.81 7.11,57.81 3.91,54.61 B1.RX
  Bottom 0.152: v41.25,53.54 47.19,47.6 47.19,43.94 46.28,43.03 46.13,43.03 41.86,38.76 41.86,36.78 43.08,35.56 GPIO_0.12
SCK1
  Top 0.152: MCU1(LCD).17 16.71,18.34 16.71,20.78 14.43,23.06 12.6,23.06 11.53,24.13 ICSP1.1
SCK2
  Top 0.152: MCU2(KPD).17 42.32,18.19 45.36,18.19 48.26,15.29 ICSP2.1
SCL  (via drill 0.35)
  Top 0.152: v33.32,42.42 33.93,43.03 33.93,47.3 35,48.36 36.98,48.36 41.86,53.24 41.86,57.05 SCL.TP | v26.62,34.95 26.62,33.88 24.79,32.05 RTC.6 | v7.72,14.22 9.55,14.22 MCU1(LCD).28 | v33.17,12.09 33.17,13.92 33.48,14.22 35,14.22 MCU2(KPD).28 | v31.8,10.72 31.8,9.96 27.69,5.84 27.69,3.56 26.31,2.18 10.77,2.18 3.91,9.04 3.91,10.11 B1.SCL
  Bottom 0.152: v33.32,42.42 33.32,41.66 v26.62,34.95 26.62,34.49 17.93,25.81 17.93,24.13 15.8,22 14.88,22 7.87,14.99 7.87,14.38 v7.72,14.22 3.76,10.26 B1.SCL | v31.8,10.72 v33.17,12.09
SDA  (via drill 0.35)
  Top 0.152: v7.26,15.14 9.55,15.14 MCU1(LCD).27 9.7,15.29 10.92,15.29 v12.6,16.97 | v34.24,42.42 34.24,47.14 35.15,48.06 37.13,48.06 45.67,56.59 45.67,57.05 SDA.TP | v28.14,34.49 28.14,34.04 26.16,32.05 RTC.5 | v28.45,27.33 28.45,21.23 34.39,15.29 35,15.29 MCU2(KPD).27
  Bottom 0.152: v7.26,15.14 4.98,12.85 4.06,12.85 3.91,12.7 B1.SDA | v34.24,42.42 34.24,40.59 v28.14,34.49 27.99,34.34 27.99,28.85 | v28.45,27.33 28.45,28.4 27.99,28.85 | v12.6,16.97 24.49,28.85 27.99,28.85
TX
  Top 0.152: B1.TX 4.67,52.93 16.56,52.93 22.35,47.14 27.53,47.14 32.87,41.81 35.46,41.81 39.12,38.15 43.08,38.15 GPIO_0.14
V0
  Top 0.152: LCD1.3 16.41,4.17 16.87,4.17 26.62,13.92 VR1.2
VCC  (via drill 0.35)
  Top 0.152: 14.73,10.57 13.97,10.57 13.67,10.26 13.67,9.8 MCU1(LCD).4 | 14.73,10.57 15.04,10.26 15.04,9.8 MCU1(LCD).6 15.04,9.65 v15.04,7.98 | 14.73,10.57 14.73,11.33 15.95,12.55 15.95,18.19 MCU1(LCD).18 | RTC.8 22.2,31.9 17.17,31.9 11.99,26.72 11.53,26.72 ICSP1.2 11.38,26.57 6.35,21.54 6.35,12.7 13.67,5.38 13.67,4.17 LCD1.2 | MCU2(KPD).4 39.12,9.8 39.12,10.26 39.42,10.57 40.18,10.57 40.49,10.26 40.49,9.8 MCU2(KPD).6 40.64,9.65 40.64,9.04 43.99,5.69 46.89,5.69 47.95,4.62 47.95,3.56 47.19,2.79 36.07,2.79 35.31,3.56 35.31,5.54 32.26,8.59 32.26,8.89 | 32.26,8.89 32.26,10.26 32.41,10.41 32.41,11.02 26.92,16.51 VR1.1 | 32.26,8.89 R1.1 | 45.06,22.45 45.36,22.76 45.67,22.76 GPIO_0.1 45.06,22.45 | 45.06,22.45 41.4,18.8 41.4,18.34 MCU2(KPD).18 | 45.06,22.45 43.54,23.98 43.08,23.98 41.71,25.35 36.83,25.35 GPIO_1.1 | ICSP2.2 50.85,15.29 50.85,27.94 52.07,29.16 B1.5V 52.07,29.31 53.59,30.84 53.59,54.76 52.53,55.83 45.52,55.83 36.98,47.3 36.98,46.99 35.61,45.62 35.61,44.55 GPIO_2.1
  Bottom 0.152: LCD1.2 13.82,4.17 13.82,4.93 15.04,6.15 v15.04,7.98 17.48,7.98 26.01,16.51 VR1.1 27.99,16.51 36.83,25.35 GPIO_1.1 | GPIO_0.1 45.82,22.91 52.07,29.16 B1.5V
X1
  Top 0.152: RTC.1 22.2,26.26 22.2,23.52 21.59,22.91 Y1.2
X2
  Top 0.152: RTC.2 23.57,26.26 23.57,23.37 24.03,22.91 Y1.1